# Altium schematic sheet SS8050_C21501_SS8050_C2150.schdoc
size 127 x 101 mm
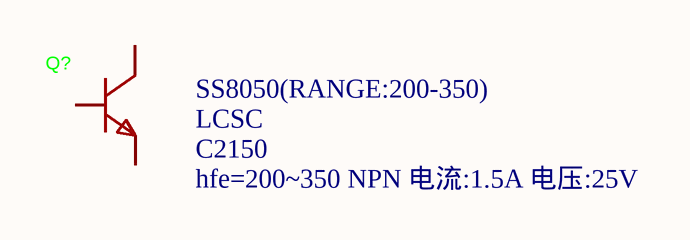
[diagram p0: SS8050_C21501_SS8050_C2150.schdoc]

## Parts
Q?  LCSC Part Name: hfe=200~350 NPN 电流:1.5A 电压:25V  Supplier Part: C2150  Supplier: LCSC  [SOT-23-3_L2.9-W1.3-P1.90-LS2.4-BR]  (hidden comment: SS8050(RANGE:200-350))

## Nets

Not connected (* = marked no-connect by the designer): Q? 1(B) 2(E) 3(C)

## Library data of the parts
Q? = SS8050(RANGE:200-350)_C2150: Manufacturer: CJ(江苏长电/长晶); Symbol: SS8050_C2150; Add into BOM: yes; type: NPN; Current - Collector(Ic): 1.5A; Collector - Emitter Voltage VCEO: 25V; Pd - Power Dissipation: 300mW; DC Current Gain: 200@800mA,1V; Transition frequency(fT): 100MHz; Current - Collector Cutoff: 100nA; Vce Saturation(VCE(sat)): 500mV@800mA,80mA; Emitter-Base Voltage(Vebo): 5V; Number: 1 NPN; Device: SS8050(RANGE:200-350)_C2150; Manufacturer Part: SS8050(RANGE:200-350); Supplier Footprint: SOT-23; JLCPCB Part Class: Basic Part; Datasheet: https://item.szlcsc.com/datasheet/SS8050(RANGE%253A200-350)/2507.html; Convert to PCB: yes; Operating Temperature: -55℃~+150℃